# Altium project amc3302.PrjPcb
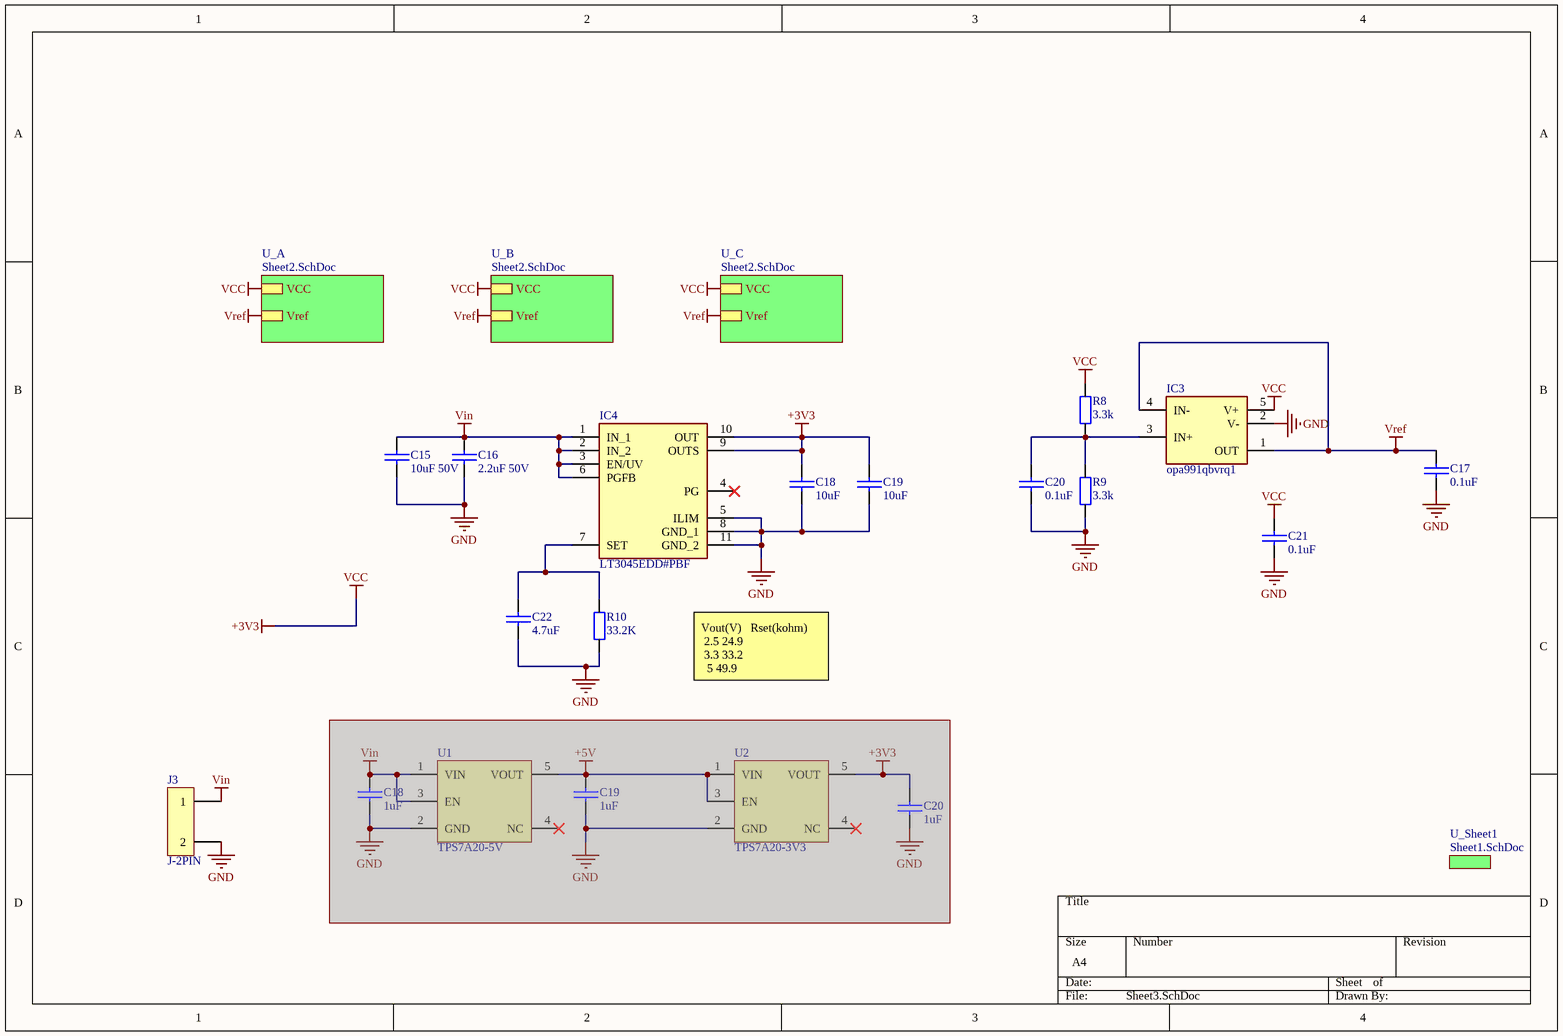
[diagram p0: Sheet3.SchDoc]
3 sheets, 151 parts. Net scope: hierarchical (ports join the sheet entries above them; power ports are global).
Board files: PCB1.PcbDoc, amc3302-v1.02.PcbDoc
Sheets:
  Sheet3.SchDoc
    U_Sheet1 = Sheet1.SchDoc
    U_A = Sheet2.SchDoc
    U_B = Sheet2.SchDoc
    U_C = Sheet2.SchDoc

## Sheet Sheet3.SchDoc
size A4; SheetNumber: 1; SheetTotal: 3

### Parts
(Parts that share a designator on the sheet are numbered #1, #2 ... from top to bottom, then left to right.)
C15#1  10uF 50V  [C-1206]
C16#1  2.2uF 50V  [C-1206]
C17#1  0.1uF  [C-0603]
C18#1  10uF  [C-1206]
C18#2  1uF  [C-0603]  (masked out: inside a compile mask, not in the netlist)
C19#1  10uF  [C-1206]
C19#2  1uF  [C-0603]  (masked out: inside a compile mask, not in the netlist)
C20#1  0.1uF  [C-0603]
C20#2  1uF  [C-0603]  (masked out: inside a compile mask, not in the netlist)
C21  0.1uF  [C-0603]
C22  4.7uF  [C-0603]
IC3#1  opa991qbvrq1  [SOT95P280X145-5N]
IC4  LT3045EDD#PBF  [SON50P300X300X80-11N-D]
J3#1  J-2PIN  [CON  7.62mm 2x1P]
R8#1  3.3k  [R-0603]
R9#1  3.3k  [R-0603]
R10#1  33.2K  [R-0603]
U1#1  TPS7A20-5V  [SOT-235]  (masked out: inside a compile mask, not in the netlist)
U2#1  TPS7A20-3V3  [SOT-235]  (masked out: inside a compile mask, not in the netlist)

### Sub-sheets
U_A = Sheet2.SchDoc: VCC, Vref
U_B = Sheet2.SchDoc: VCC, Vref
U_C = Sheet2.SchDoc: VCC, Vref
U_Sheet1 = Sheet1.SchDoc: no entries

### Nets
+3V3: C18#1.1 C19#1.1 C21.2 IC3#1.5(V+) IC4.9(OUTS) IC4.10(OUT) R8#1.2 ; sheet U_A/VCC, sheet U_B/VCC, sheet U_C/VCC  [also labelled VCC]
GND: C15#1.2 C16#1.2 C17#1.1 C18#1.2 C19#1.2 C20#1.1 C21.1 C22.2 IC3#1.2(V-) IC4.5(ILIM) IC4.8(GND_1) IC4.11(GND_2) J3#1.2 R9#1.1 R10#1.2
Vin: C15#1.1 C16#1.1 IC4.1(IN_1) IC4.2(IN_2) IC4.3(EN/UV) IC4.6(PGFB) J3#1.1
Vref: C17#1.2 IC3#1.1(OUT) IC3#1.4(IN-) ; sheet U_A/Vref, sheet U_B/Vref, sheet U_C/Vref
NetC20#1_2: C20#1.2 IC3#1.3(IN+) R8#1.1 R9#1.2
NetC22_1: C22.1 IC4.7(SET) R10#1.1

Not connected (* = marked no-connect by the designer): IC4 4(PG)*

### Notes on the sheet
- Vout(V)   Rset(kohm)
  2.5	24.9
  3.3	33.2
  5	49.9

### Library data of the parts
C15#1 C16#1 C17#1 C18#1 C18#2 C19#1 C19#2 C20#1 C20#2 C21 C22 = C: Non Polarised
IC3#1 = TLV9001IDBVR: Integrated Circuit; Manufacturer_Name: Texas Instruments; Datasheet Link: http://www.ti.com/lit/gpn/tlv9001; Height: 1.45mm; Manufacturer_Part_Number: TLV9001IDBVR; Mouser Part Number: 595-TLV9001IDBVR; Mouser Price/Stock: https://www.mouser.co.uk/ProductDetail/Texas-Instruments/TLV9001IDBVR?qs=gTYE2QTfZfR6dUkET6Yj7w%3D%3D; Arrow Part Number: TLV9001IDBVR; Arrow Price/Stock: https://www.arrow.com/en/products/tlv9001idbvr/texas-instruments?region=europe
IC4 = LT3045EDD#PBF: Integrated Circuit; Manufacturer_Name: Analog Devices; Datasheet Link: https://www.analog.com/LT3045/datasheet; Height: 0.8mm; Manufacturer_Part_Number: LT3045EDD#PBF; Mouser Part Number: 584-LT3045EDD#PBF; Mouser Price/Stock: https://www.mouser.co.uk/ProductDetail/Analog-Devices/LT3045EDDPBF?qs=oahfZPh6IAItEW%2FaDCA8LQ%3D%3D; Arrow Part Number: LT3045EDD#PBF; Arrow Price/Stock: https://www.arrow.com/en/products/lt3045eddpbf/analog-devices?utm_currency=USD&region=europe
R8#1 R9#1 R10#1 = R: Resistor
U1#1 U2#1 = TPS7A20-3V3: LDO  最大输出300mA

## Sheet Sheet1.SchDoc
size A4; SheetNumber: 2; SheetTotal: 3
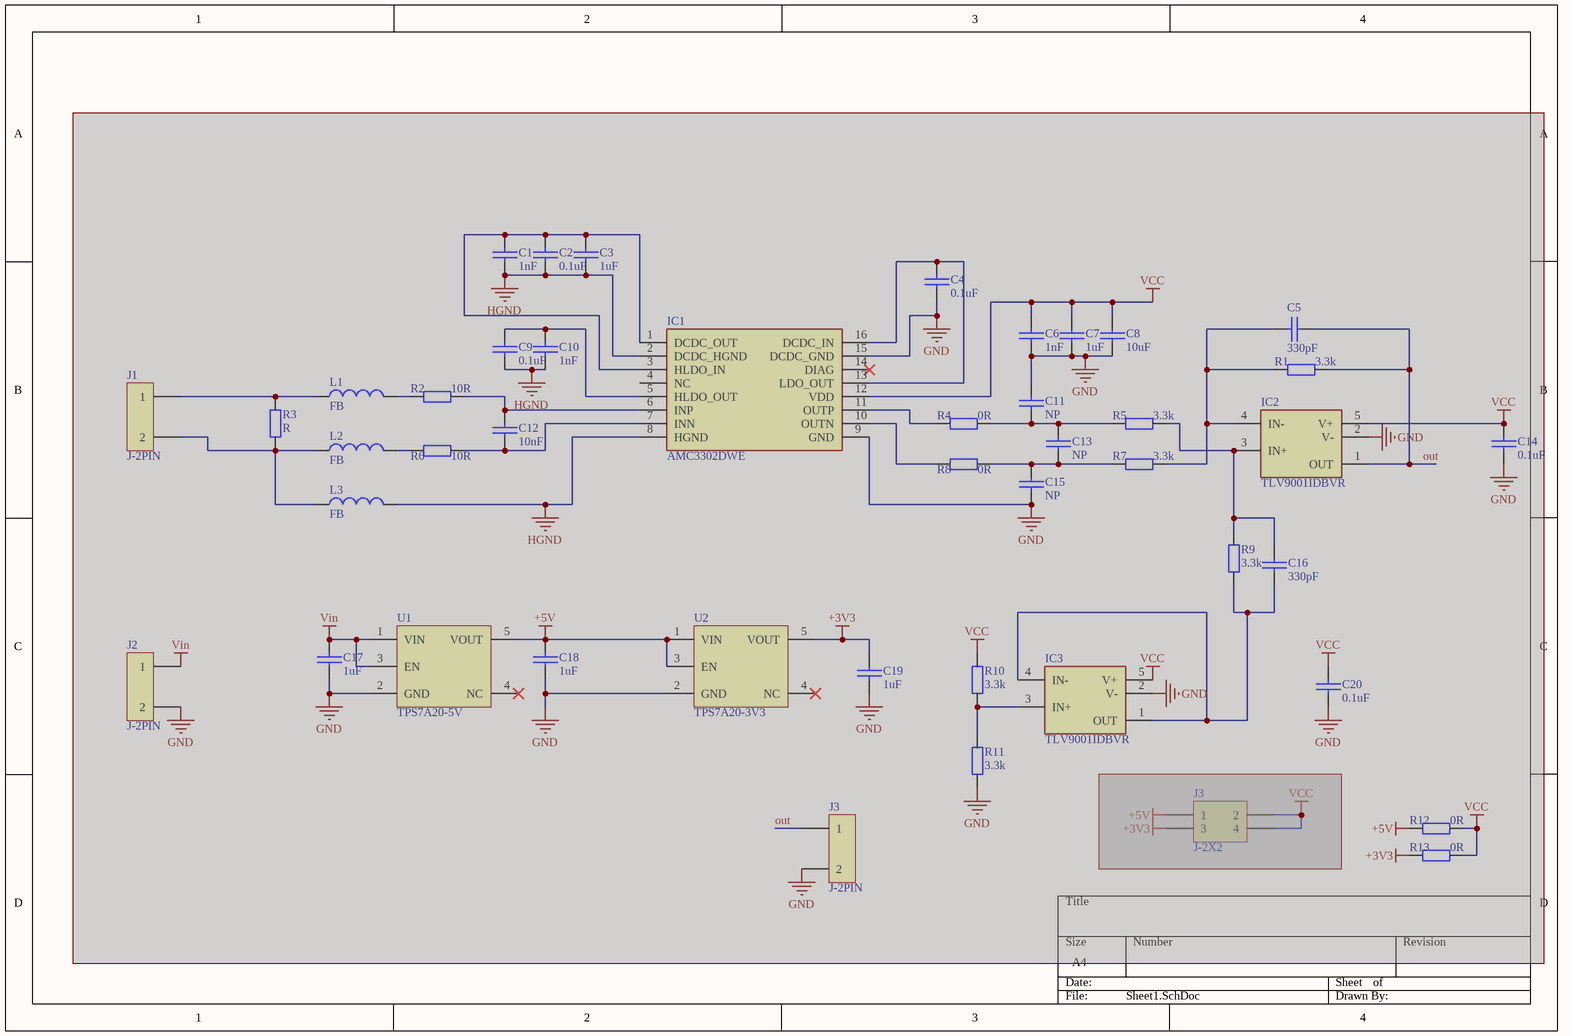
[diagram p1: Sheet1.SchDoc]

### Parts
(Parts that share a designator on the sheet are numbered #1, #2 ... from top to bottom, then left to right.)
C1  1nF  [C-0603]  (masked out: inside a compile mask, not in the netlist)
C2  0.1uF  [C-0603]  (masked out: inside a compile mask, not in the netlist)
C3  1uF  [C-0603]  (masked out: inside a compile mask, not in the netlist)
C4  0.1uF  [C-0603]  (masked out: inside a compile mask, not in the netlist)
C5  330pF  [C-0603]  (masked out: inside a compile mask, not in the netlist)
C6  1nF  [C-0603]  (masked out: inside a compile mask, not in the netlist)
C7  1uF  [C-0603]  (masked out: inside a compile mask, not in the netlist)
C8  10uF  [C-0603]  (masked out: inside a compile mask, not in the netlist)
C9  0.1uF  [C-0603]  (masked out: inside a compile mask, not in the netlist)
C10  1nF  [C-0603]  (masked out: inside a compile mask, not in the netlist)
C11  NP  [C-0603]  (masked out: inside a compile mask, not in the netlist)
C12  10nF  [C-0603]  (masked out: inside a compile mask, not in the netlist)
C13  NP  [C-0603]  (masked out: inside a compile mask, not in the netlist)
C14  0.1uF  [C-0603]  (masked out: inside a compile mask, not in the netlist)
C15#2  NP  [C-0603]  (masked out: inside a compile mask, not in the netlist)
C16#2  330pF  [C-0603]  (masked out: inside a compile mask, not in the netlist)
C17#2  1uF  [C-0603]  (masked out: inside a compile mask, not in the netlist)
C18#3  1uF  [C-0603]  (masked out: inside a compile mask, not in the netlist)
C19#3  1uF  [C-0603]  (masked out: inside a compile mask, not in the netlist)
C20#3  0.1uF  [C-0603]  (masked out: inside a compile mask, not in the netlist)
IC1  AMC3302DWE  [SOIC127P1030X265-16N]  (masked out: inside a compile mask, not in the netlist)
IC2  TLV9001IDBVR  [SOT95P280X145-5N]  (masked out: inside a compile mask, not in the netlist)
IC3#2  TLV9001IDBVR  [SOT95P280X145-5N]  (masked out: inside a compile mask, not in the netlist)
J1  J-2PIN  [CON  7.62mm 2x1P]  (masked out: inside a compile mask, not in the netlist)
J2  J-2PIN  [J-VH3.96-2A]  (masked out: inside a compile mask, not in the netlist)
J3#2  J-2X2  [PCBComponent_1]  (masked out: inside a compile mask, not in the netlist)
J3#3  J-2PIN  [SMA RF同轴链接器]  (masked out: inside a compile mask, not in the netlist)
L1  FB  [L-0402]  (masked out: inside a compile mask, not in the netlist)
L2  FB  [L-0402]  (masked out: inside a compile mask, not in the netlist)
L3  FB  [L-0402]  (masked out: inside a compile mask, not in the netlist)
R1  3.3k  [R-0603]  (masked out: inside a compile mask, not in the netlist)
R2  10R  [R-0603]  (masked out: inside a compile mask, not in the netlist)
R3  R  [R-2512]  (masked out: inside a compile mask, not in the netlist)
R4  0R  [R-0603]  (masked out: inside a compile mask, not in the netlist)
R5  3.3k  [R-0603]  (masked out: inside a compile mask, not in the netlist)
R6  10R  [R-0603]  (masked out: inside a compile mask, not in the netlist)
R7  3.3k  [R-0603]  (masked out: inside a compile mask, not in the netlist)
R8#2  0R  [R-0603]  (masked out: inside a compile mask, not in the netlist)
R9#2  3.3k  [R-0603]  (masked out: inside a compile mask, not in the netlist)
R10#2  3.3k  [R-0603]  (masked out: inside a compile mask, not in the netlist)
R11  3.3k  [R-0603]  (masked out: inside a compile mask, not in the netlist)
R12  0R  [R-0603]  (masked out: inside a compile mask, not in the netlist)
R13  0R  [R-0603]  (masked out: inside a compile mask, not in the netlist)
U1#2  TPS7A20-5V  [SOT-235]  (masked out: inside a compile mask, not in the netlist)
U2#2  TPS7A20-3V3  [SOT-235]  (masked out: inside a compile mask, not in the netlist)

### Library data of the parts
C1-C14 C15#2 C16#2 C17#2 C18#3 C19#3 C20#3 = C: Non Polarised
IC1 = AMC3302DWE: Integrated Circuit; Manufacturer_Name: Texas Instruments; Datasheet Link: https://www.ti.com/lit/ds/symlink/amc3302.pdf?ts=1643366130509; Height: 2.65mm; Manufacturer_Part_Number: AMC3302DWE; Mouser Part Number: 595-AMC3302DWE; Mouser Price/Stock: https://www.mouser.co.uk/ProductDetail/Texas-Instruments/AMC3302DWE?qs=DRkmTr78QAT3OfY8Rd%252BeWA%3D%3D; Arrow Part Number: AMC3302DWE; Arrow Price/Stock: https://www.arrow.com/en/products/amc3302dwe/texas-instruments?region=nac
IC2 IC3#2 = TLV9001IDBVR: as IC3#1 on sheet Sheet3; Datasheet Link: http://www.ti.com/lit/gpn/tlv9001; Height: 1.45mm; Manufacturer_Part_Number: TLV9001IDBVR; Mouser Part Number: 595-TLV9001IDBVR; Mouser Price/Stock: https://www.mouser.co.uk/ProductDetail/Texas-Instruments/TLV9001IDBVR?qs=gTYE2QTfZfR6dUkET6Yj7w%3D%3D; Arrow Part Number: TLV9001IDBVR; Arrow Price/Stock: https://www.arrow.com/en/products/tlv9001idbvr/texas-instruments?region=europe
L1-L3 = L-SMD: 1.8k@100Mhz
R1-R7 R8#2 R9#2 R10#2 R11-R13 = R: Resistor
U1#2 U2#2 = TPS7A20-3V3: LDO  最大输出300mA
J3#2 = J-2X2: LatestRevisionDate: 17-Jul-2002; LatestRevisionNote: Re-released for DXP Platform.; Publisher: Altium Limited

## Sheet Sheet2.SchDoc
size A4; SheetNumber: 3; SheetTotal: 3
Used 3 times, as channels U_A, U_B, U_C. Parts and nets are listed once, with the designators drawn on the sheet.
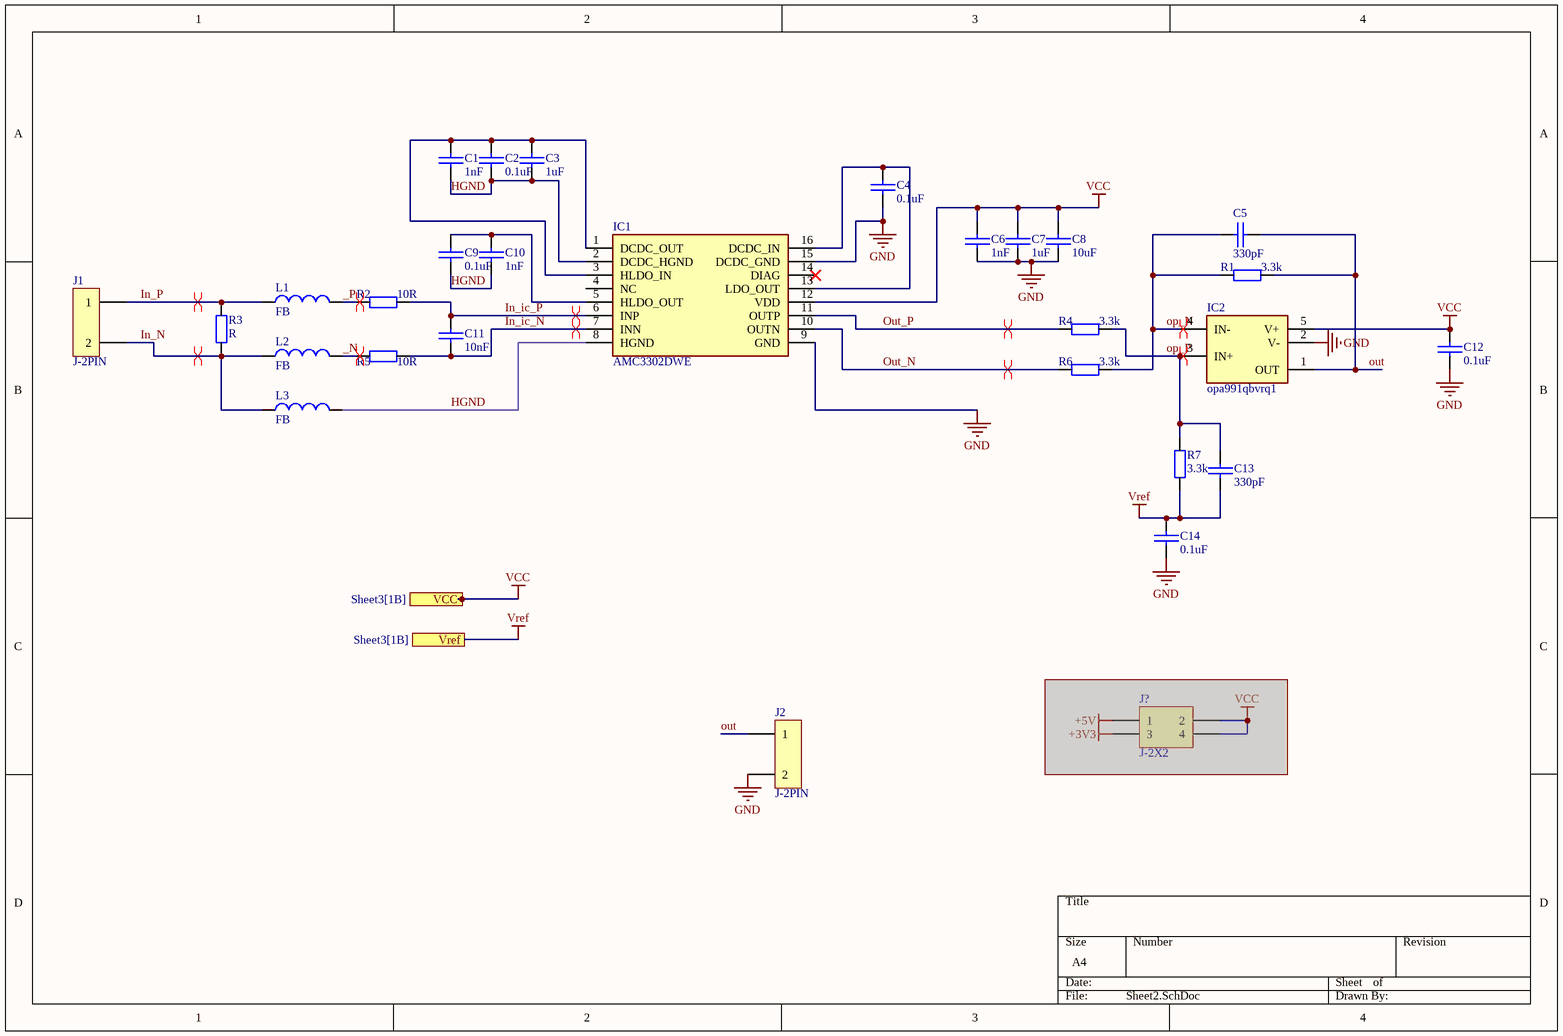
[diagram p2: Sheet2.SchDoc]

### Parts
C1  1nF  [C-0603]
C2  0.1uF  [C-0603]
C3  1uF  [C-0603]
C4  0.1uF  [C-0603]
C5  330pF  [C-0603]
C6  1nF  [C-0603]
C7  1uF  [C-0603]
C8  10uF  [C-0603]
C9  0.1uF  [C-0603]
C10  1nF  [C-0603]
C11  10nF  [C-0603]
C12  0.1uF  [C-0603]
C13  330pF  [C-0603]
C14  0.1uF  [C-0603]
IC1  AMC3302DWE  [SOIC127P1030X265-16N]
IC2  opa991qbvrq1  [SOT95P280X145-5N]
J1  J-2PIN  [2pin]
J2  J-2PIN  [SMA RF同轴链接器]
J?  J-2X2  [PCBComponent_1]  (masked out: inside a compile mask, not in the netlist)
L1  FB  [L-0402]
L2  FB  [L-0402]
L3  FB  [L-0402]
R1  3.3k  [R-0603]
R2  10R  [R-0603]
R3  R  [R-2512]
R4  3.3k  [R-0603]
R5  10R  [R-0603]
R6  3.3k  [R-0603]
R7  3.3k  [R-0603]

### Ports
VCC (see Sheet3[1B]), Vref (see Sheet3[1B])

### Nets
GND: C4.2 C6.2 C7.2 C8.2 C12.1 C14.1 IC1.9(GND) IC1.15(DCDC_GND) IC2.2(V-) J2.2
VCC: C6.1 C7.1 C8.1 C12.2 IC1.12(VDD) IC2.5(V+) ; port VCC
Vref: C13.1 C14.2 R7.1 ; port Vref
_N: L2.2 R5.1
_P: L1.2 R2.1
HGND: C1.2 C2.2 C3.2 C9.2 C10.2 IC1.2(DCDC_HGND) IC1.8(HGND) L3.2
In_ic_N: C11.2 IC1.7(INN) R5.2
In_ic_P: C11.1 IC1.6(INP) R2.2
In_N: J1.2 L2.1 L3.1 R3.1
In_P: J1.1 L1.1 R3.2
op_N: C5.1 IC2.4(IN-) R1.1 R6.2
op_P: C13.2 IC2.3(IN+) R4.2 R7.2
out: C5.2 IC2.1(OUT) J2.1 R1.2
Out_N: IC1.10(OUTN) R6.1
Out_P: IC1.11(OUTP) R4.1
NetC1_1: C1.1 C2.1 C3.1 IC1.1(DCDC_OUT) IC1.3(HLDO_IN)
NetC4_1: C4.1 IC1.13(LDO_OUT) IC1.16(DCDC_IN)
NetC9_1: C9.1 C10.1 IC1.5(HLDO_OUT)

Not connected (* = marked no-connect by the designer): IC1 4(NC) 14(DIAG)*

### Channels
U_A: designators end in _U_A; ports VCC=+3V3 Vref=Vref
U_B: designators end in _U_B; ports VCC=+3V3 Vref=Vref
U_C: designators end in _U_C; ports VCC=+3V3 Vref=Vref

### Layout directives
differential pair: _N_U_A, _P_U_A, In_ic_N_U_A, In_ic_P_U_A, In_N_U_A, In_P_U_A, op_N_U_A, op_P_U_A, Out_N_U_A, Out_P_U_A

### Library data of the parts
C1-C14 = C: Non Polarised
IC1 = AMC3302DWE: as IC1 on sheet Sheet1; Datasheet Link: https://www.ti.com/lit/ds/symlink/amc3302.pdf?ts=1643366130509; Height: 2.65mm; Manufacturer_Part_Number: AMC3302DWE; Mouser Part Number: 595-AMC3302DWE; Mouser Price/Stock: https://www.mouser.co.uk/ProductDetail/Texas-Instruments/AMC3302DWE?qs=DRkmTr78QAT3OfY8Rd%252BeWA%3D%3D; Arrow Part Number: AMC3302DWE; Arrow Price/Stock: https://www.arrow.com/en/products/amc3302dwe/texas-instruments?region=nac
IC2 = TLV9001IDBVR: as IC3#1 on sheet Sheet3; Datasheet Link: http://www.ti.com/lit/gpn/tlv9001; Height: 1.45mm; Manufacturer_Part_Number: TLV9001IDBVR; Mouser Part Number: 595-TLV9001IDBVR; Mouser Price/Stock: https://www.mouser.co.uk/ProductDetail/Texas-Instruments/TLV9001IDBVR?qs=gTYE2QTfZfR6dUkET6Yj7w%3D%3D; Arrow Part Number: TLV9001IDBVR; Arrow Price/Stock: https://www.arrow.com/en/products/tlv9001idbvr/texas-instruments?region=europe
L1-L3 = L-SMD: 1.8k@100Mhz
R1-R7 = R: Resistor
J? = J-2X2: LatestRevisionDate: 17-Jul-2002; LatestRevisionNote: Re-released for DXP Platform.; Publisher: Altium Limited

## Nets that join several sheets
+3V3: Sheet3 (7 pins), U_A (6 pins), U_B (6 pins), U_C (6 pins)
GND: Sheet3 (15 pins), U_A (10 pins), U_B (10 pins), U_C (10 pins)
Vref: Sheet3 (C17#1.2 IC3#1.1 IC3#1.4), U_A (C13_U_A.1 C14_U_A.2 R7_U_A.1), U_B (C13_U_B.1 C14_U_B.2 R7_U_B.1), U_C (C13_U_C.1 C14_U_C.2 R7_U_C.1)